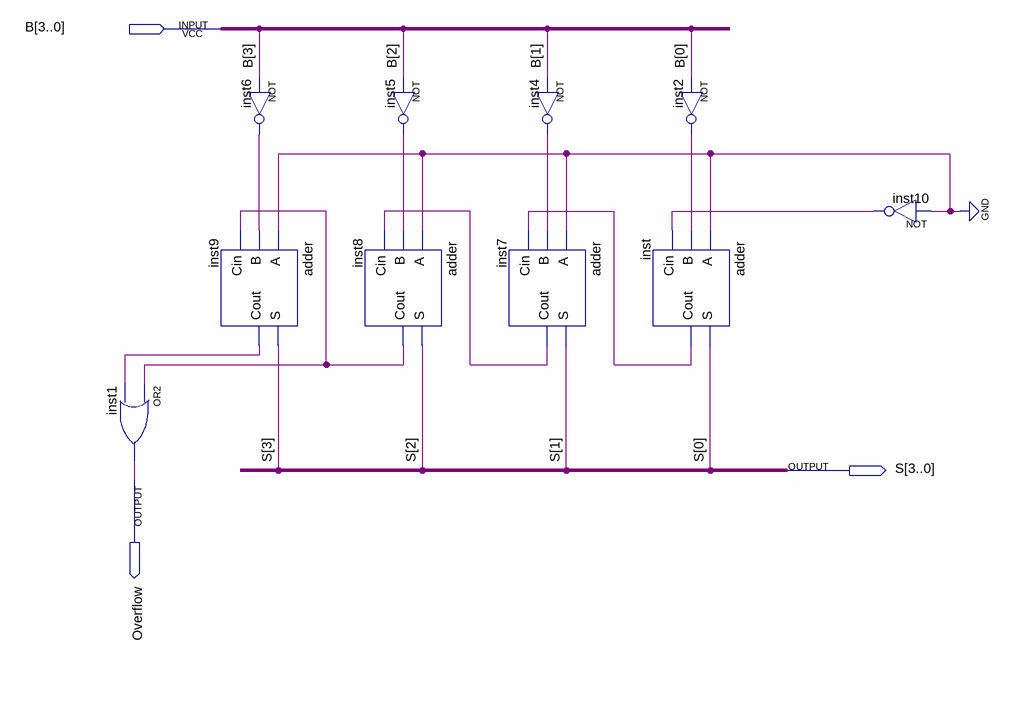
[diagram p0: schematic sheet]
// Quartus schematic c2b.bdf as structural Verilog: 10 symbols, 3 pins
module c2b (
  input  [3:0] B,
  output [3:0] S,
  output Overflow
);

  wire inst2_out, inst4_out, inst5_out, inst6_out, inst7_cout, inst8_cout, inst9_cout, inst10_out, inst_cout;

  or inst1 (Overflow, inst8_cout, inst9_cout);
  not inst6 (inst6_out, B[3]);
  adder inst9 (.A(1'b0), .B(inst6_out), .Cin(inst8_cout), .S(S[3]), .Cout(inst9_cout));
  not inst5 (inst5_out, B[2]);
  adder inst8 (.A(1'b0), .B(inst5_out), .Cin(inst7_cout), .S(S[2]), .Cout(inst8_cout));
  not inst4 (inst4_out, B[1]);
  adder inst7 (.A(1'b0), .B(inst4_out), .Cin(inst_cout), .S(S[1]), .Cout(inst7_cout));
  adder inst (.A(1'b0), .B(inst2_out), .Cin(inst10_out), .S(S[0]), .Cout(inst_cout));
  not inst2 (inst2_out, B[0]);
  not inst10 (inst10_out, 1'b0);
endmodule
